# EAGLE design mb_01-4 (EAGLE 7.7.0)
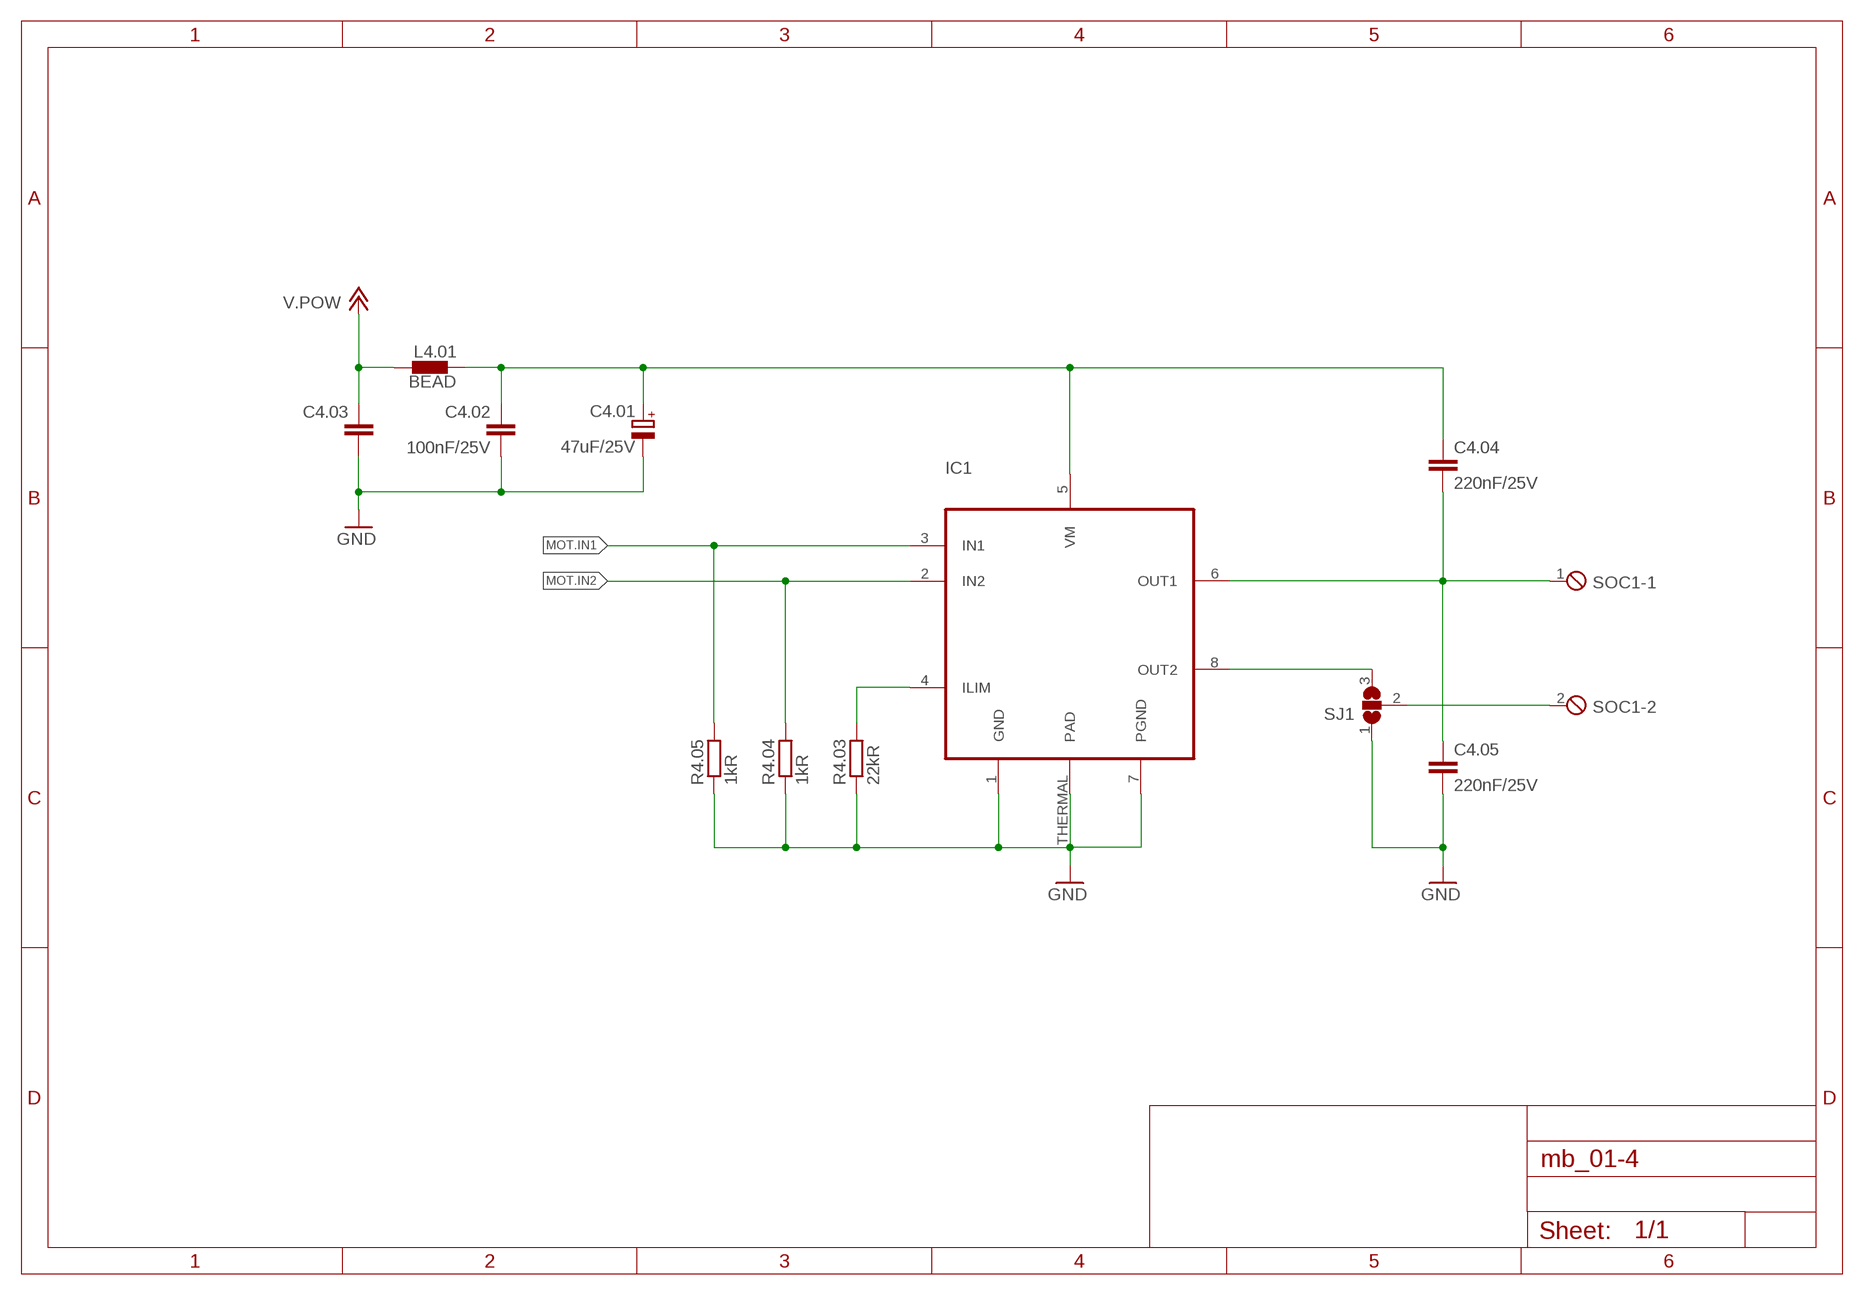
[diagram p0: schematic, sheet 1]

## Parts
C4.01  47uF/25V  CPOL-EUC/6032-28R  [C/6032-28R]
C4.02  100nF/25V  C-EUC0603K  [C0603K]
C4.03  C-EUC0805K  [C0805K]
C4.04  220nF/25V  C-EUC0603K  [C0603K]
C4.05  220nF/25V  C-EUC0603K  [C0603K]
IC1  DRV8871  [HSOP8]
L4.01  BEAD  BLM15HB121SN1  [0402]
R4.03  22kR  R-EU_R0402  [R0402]
R4.04  1kR  R-EU_R0402  [R0402]
R4.05  1kR  R-EU_R0402  [R0402]
SJ1  SJ2W  [SJ_2]
SOC1  MPT2  [2POL254]

## Nets
+12V: C4.03.1 L4.01.2 ; supply symbol labelled V.POW
GND: C4.01.- C4.02.2 C4.03.2 C4.05.2 IC1.1(GND) IC1.7(PGND) IC1.THERMAL(PAD) R4.03.1 R4.04.1 R4.05.1 SJ1.1
MOT.IN1: IC1.3(IN1) R4.05.2
MOT.IN2: IC1.2(IN2) R4.04.2
N$9: SJ1.2 SOC1.2
N$10: C4.01.+ C4.02.1 C4.04.1 IC1.5(VM) L4.01.1
N$33: C4.04.2 C4.05.1 IC1.6(OUT1) SOC1.1
N$34: IC1.8(OUT2) SJ1.3
N$35: IC1.4(ILIM) R4.03.2

## Library data of the parts
C4.01 = rcl:CPOL-EU: POLARIZED CAPACITOR, European symbol
C4.02 C4.03 = resistor:C-EU: CAPACITOR, European symbol
C4.04 C4.05 = rcl:C-EU: CAPACITOR, European symbol
IC1 = kitt.ic:DRV8871
L4.01 = inductors:BLM15H: EMIFIL (R) Chip Ferrite Bead for GHz Noise Source: http://www.murata.com/ Ferrite Bead BLM15H.pdf
R4.03-R4.05 = resistor:R-EU_: RESISTOR, European symbol
SJ1 = jumper:SJ2W: SMD solder JUMPER
SOC1 = con-phoenix-254:MPT2: PHOENIX CONNECTOR; OC_FARNELL: unknown; OC_NEWARK: unknown

## Board
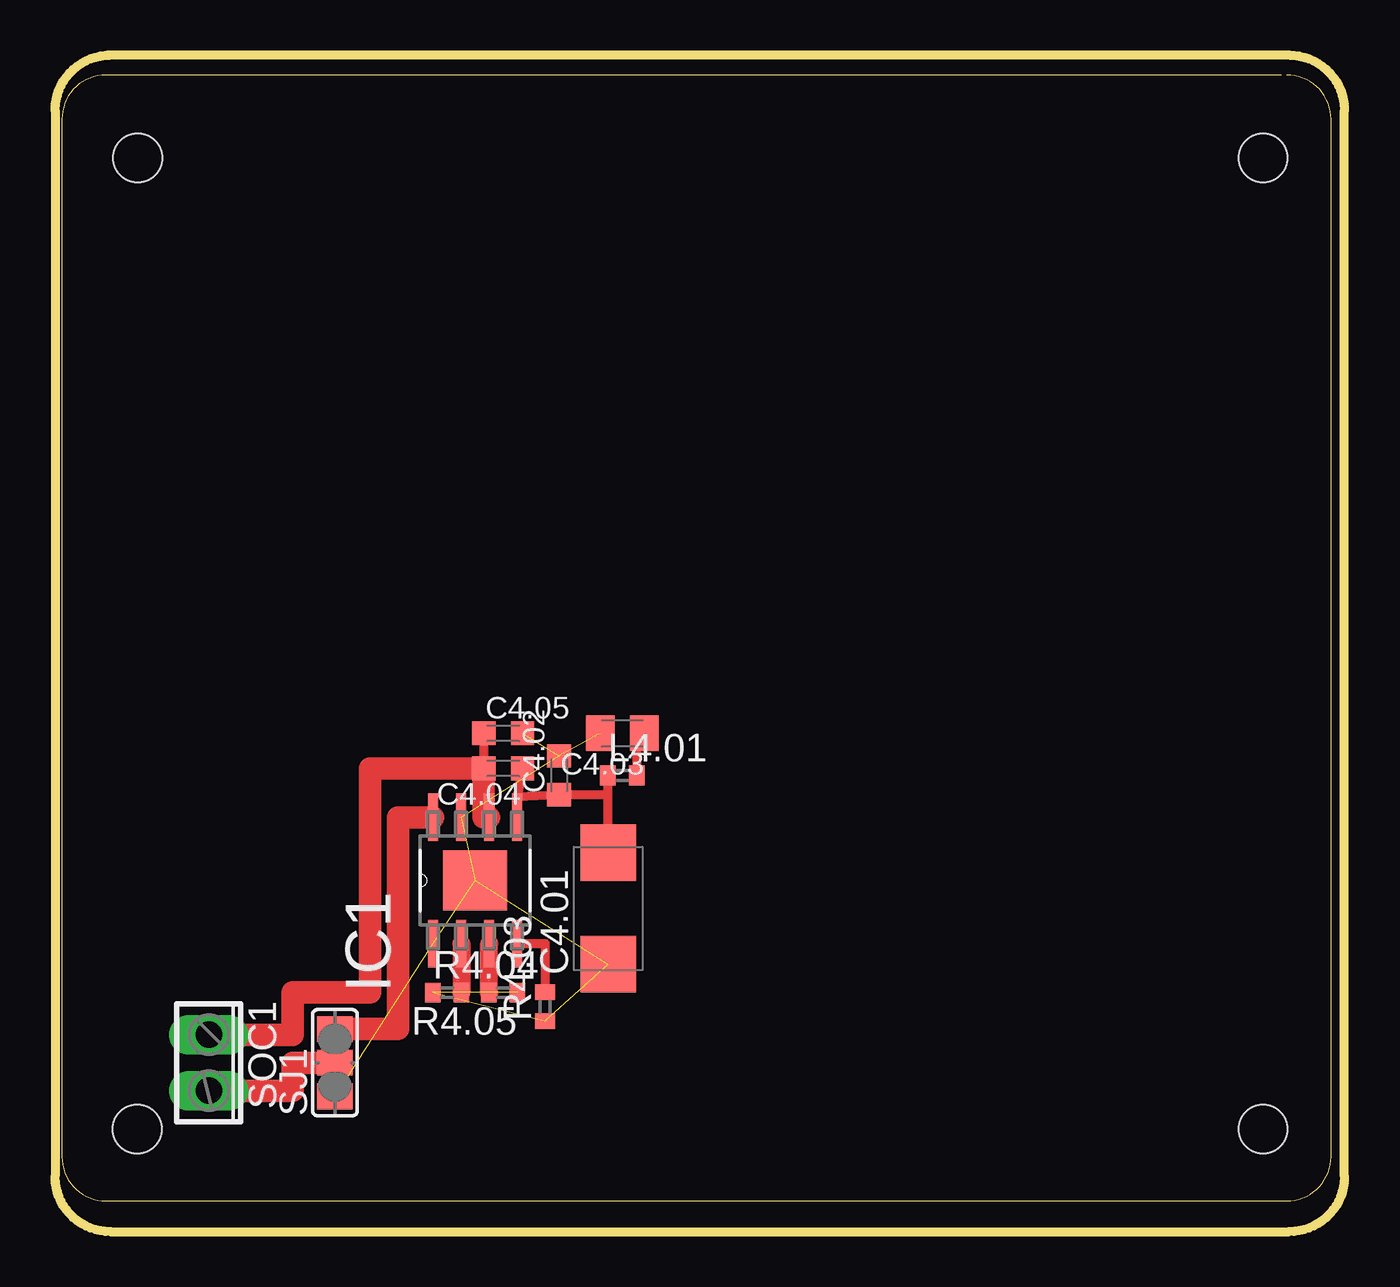
[diagram p1: board, top side]

Size 58.4 x 53.3 mm. Coordinates in mm from the lower left corner, seen from the top.
Outline: 55.55,52.4 2.3,52.4 arc90 0.3,50.4 0.3,3.4 arc90 2.3,1.4 55.8,1.4 arc90 57.8,3.4 57.8,50.4 arc90 55.8,52.4
Outline: 2.5,53.3 arc90 0,50.8 0,2.5 arc90 2.5,0 55.9,0 arc90 58.4,2.5 58.4,50.8 arc90 55.9,53.3 2.4,53.3
Copper layers (1*2+3*4+5*6+7*16): Top 0.035mm / dielectric 0.2mm / Route2 0.035mm / dielectric 0.15mm / Route3 0.035mm / dielectric 0.2mm / layer 4 0.035mm / dielectric 0.15mm / layer 5 0.035mm / dielectric 0.2mm / layer 6 0.035mm / dielectric 0.15mm / layer 7 0.035mm / dielectric 0.2mm / Bottom 0.035mm
Design rules "default *": minimum track width 6mil, minimum drill 0.25mm, track to track 6mil, track to pad 8mil, pad to pad 8mil, via to via 6mil, smd to smd 8mil, copper to edge 12mil, drill to drill 24mil, minimum pad ring 9mil, minimum via ring 9mil, stop-mask expansion 3mil, vias tented up to drill 0mil, thermal gap 12mil
Holes 2.2 mm at 3.72,4.65 54.72,4.65 3.74,48.64 54.72,48.64
Milling: 4 lines

### Footprints (pad centres in the part's own frame; a part is rotated, then mirrored left to right if it is on the bottom)
C/6032-28R = smd 2.55 x 2.5: + 2.525,0; - -2.525,0
C0603K = smd 1.05 x 1.08: 1 -0.875,0; 2 0.875,0
C0805K = smd 1.3 x 1.6: 1 -1,0; 2 1,0
HSOP8 = smd 2.15 x 0.45: 1 -2.857,1.905; 2 -2.857,0.635; 3 -2.857,-0.635; 4 -2.857,-1.905; 5 2.857,-1.905; 6 2.857,-0.635; 7 2.857,0.635; 8 2.857,1.905 | smd 2.7 x 2.9: THERMAL 0,0
0402 = smd 0.7 x 0.9: 1 -0.65,0; 2 0.65,0
R0402 = smd 0.7 x 0.9: 1 -0.65,0; 2 0.65,0
SJ_2 = smd 1.168 x 1.6: 1 -1.524,0; 2 0,0; 3 1.524,0
2POL254 = drill 1.2 long: 1 -1.27,0; 2 1.27,0

### Placement (x,y rotation side)
C4.01  25.05,14.64 90 top
C4.02  22.83,20.67 90 top
C4.03  25.69,22.58 180 top
C4.04  20.29,20.99 180 top
C4.05  20.29,22.58 0 top
IC1  19.02,15.91 90 top
L4.01  25.69,20.67 0 top
R4.03  22.2,10.2 90 top
R4.04  17.75,10.83 0 top
R4.05  20.29,10.83 180 top
SJ1  12.67,7.66 90 top
SOC1  6.96,7.66 270 top
U$1  [REF_GCB2_TS]  4.42,0.35 0 top

### Tracks (layer width: path | path; a pad name or v marks a point on that pad's centre or on a via)
+12V
  Top 0.406: C4.03.1 26.34,22.58 L4.01.2
GND  (10 unrouted)
MOT.IN1
  Top 0.813: R4.05.2 19.66,10.83 IC1.3
MOT.IN2
  Top 0.406: IC1.2 18.4,13.05
  Top 0.813: 18.4,13.05 R4.04.2
N$9
  Top 1.016: SOC1.2 10.77,6.39 10.77,7.66 SJ1.2
N$10
  Top 0.406: 25.04,19.8 C4.02.1 20.93,19.72 | 25.04,19.8 L4.01.1 | C4.01.+ 25.04,19.8 | C4.04.1 20.93,19.72 | IC1.5 20.93,19.72
N$33
  Top 0.406: C4.05.1 C4.04.2 19.73,20.99
  Top 1.016: IC1.6 19.42,18.77 C4.04.2 14.26,20.99 14.26,10.83 10.77,10.83 10.77,8.93 SOC1.1
N$34
  Top 1.016: SJ1.3 15.53,9.18 15.53,18.77 IC1.8
N$35
  Top 0.406: IC1.4 22.2,13.05 R4.03.2

### Text on the board
Milling: EAGLE EDU LIMIT
Reference: Motor Leads --> | <-- Rail Power Leads